# Altium schematic sheet VCO.SchDoc (part 3 of 3)
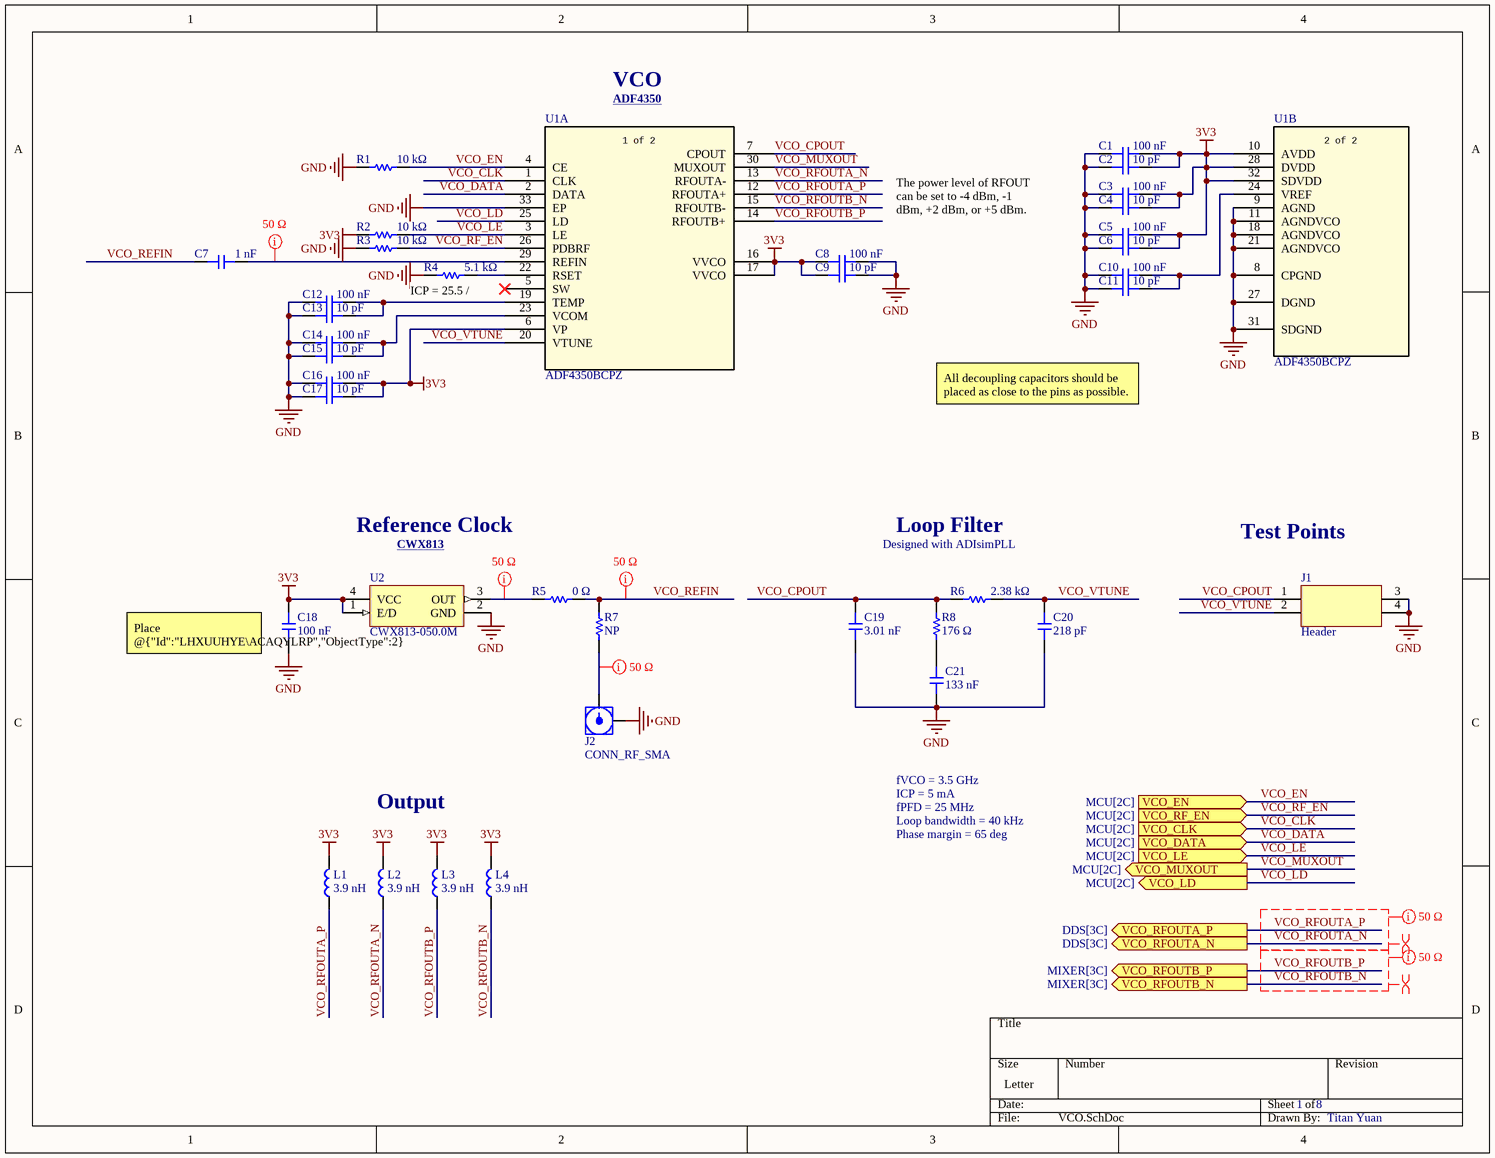
[diagram p2: VCO.SchDoc]

## Library data of the parts (continued)
R4 = RES: 62.5mW Thick Film Resistors 50V ±100ppm/℃ ±1% 5.1kΩ 0402 Chip Resistor - Surface Mount ROHS; Manufacturer: Yageo; Manufacturer Part Number: RC0402FR-075K1L; Tolerance: +-1%; Power Rating: 1/16 W; Max Power Dissipation: 63mW; Temperature Coefficient: 100ppm/°C; Package Size: 0402; Supplier: DigiKey; Supplier Part Number: 311-5.10KLRCT-ND; RoHS: Compliant; Category: Chip SMD Resistors; Stock: 744508; Pricing: 1=0.1, 10=0.008, 25=0.0068, 50=0.005, 100=0.0046, 250=0.00328, 10000=0.00204, 20000=0.002, 30000=0.00196, 50000=0.00182, 70000=0.00181 (USD); Case/Package: 0402; Case Code (Imperial): 0402; China RoHS: Non-Compliant; Composition: Thick Film; Country of Origin: Mainland China, Taiwan; Depth: 500µm; Export Control Classification Number (ECCN) Code: EAR99; Features: Moisture Resistant; Height: 350µm; Harmonized Tariff Schedule (HTS) Code: 8533.21.00.30; Introduction Date: 2008-07-18; Lead Free: Lead Free; Length: 1mm; Lifecycle Status: Production; Max Operating Temperature: 155°C; Military Standard: Not; Min Operating Temperature: -55°C; Mounting Technology: Surface Mount; Pins: 2; Number of Terminals: 2; Number of Terminations: 2; Packaging: Cut Tape; Power Dissipation: 62.5mW; REACH SVHC: Yes; Value: 5.1kΩ; Schedule B: 8533210045, 8533210045|8533210045, 8533210045|8533210045|8533210045, 8533210045|8533210045|8533210045|8533210045; Termination: SMD/SMT; Voltage Rating: 50V; Voltage Rating (DC): 50V; Width: 500µm; Working Voltage: 50V; ComponentLink1URL: https://datasheet.octopart.com:443/RC0402FR-075K1L-Yageo-datasheet-175887523.pdf?src-supplier=IHS; ComponentLink1Description: https://datasheet.octopart.com:443/RC0402FR-075K1L-Yageo-datasheet-175887523.pdf?src-supplier=IHS; ComponentLink2URL: https://datasheet.octopart.com:443/RC0402FR-075K1L-Yageo-datasheet-103092701.pdf?src-supplier=Upverter; ComponentLink2Description: https://datasheet.octopart.com:443/RC0402FR-075K1L-Yageo-datasheet-103092701.pdf?src-supplier=Upverter; ComponentLink3URL: https://datasheet.octopart.com:443/RC0402FR-075K1L-Yageo-Group-datasheet-190305687.pdf?src-supplier=Future+Electronics; ComponentLink3Description: https://datasheet.octopart.com:443/RC0402FR-075K1L-Yageo-Group-datasheet-190305687.pdf?src-supplier=Future+Electronics; ComponentLink4URL: https://datasheet.octopart.com:443/RC0402FR-075K1L-Yageo-datasheet-164759695.pdf?src-supplier=Future+Electronics; ComponentLink4Description: https://datasheet.octopart.com:443/RC0402FR-075K1L-Yageo-datasheet-164759695.pdf?src-supplier=Future+Electronics; ComponentLink5URL: https://datasheet.octopart.com:443/RC0402FR-075K1L-Yageo-datasheet-137700087.pdf?src-supplier=Future+Electronics; ComponentLink5Description: https://datasheet.octopart.com:443/RC0402FR-075K1L-Yageo-datasheet-137700087.pdf?src-supplier=Future+Electronics; ComponentLink6URL: https://datasheet.octopart.com:443/RC0402FR-075K1L-Yageo-datasheet-12531192.pdf?src-supplier=Future+Electronics; ComponentLink6Description: https://datasheet.octopart.com:443/RC0402FR-075K1L-Yageo-datasheet-12531192.pdf?src-supplier=Future+Electronics; ComponentLink7URL: https://datasheet.octopart.com:443/RC0402FR-075K1L-Yageo-datasheet-505231.pdf?src-supplier=Future+Electronics; ComponentLink7Description: https://datasheet.octopart.com:443/RC0402FR-075K1L-Yageo-datasheet-505231.pdf?src-supplier=Future+Electronics; ComponentLink8URL: https://datasheet.octopart.com:443/RC0402FR-075K1L-Yageo-datasheet-10408619.pdf?src-supplier=Newark; ComponentLink8Description: https://datasheet.octopart.com:443/RC0402FR-075K1L-Yageo-datasheet-10408619.pdf?src-supplier=Newark; ComponentLink9URL: https://datasheet.octopart.com:443/RC0402FR-075K1L-Yageo-datasheet-8324527.pdf?src-supplier=Newark; ComponentLink9Description: https://datasheet.octopart.com:443/RC0402FR-075K1L-Yageo-datasheet-8324527.pdf?src-supplier=Newark; ComponentLink10URL: https://datasheet.octopart.com:443/RC0402FR-075K1L-Yageo-datasheet-62067350.pdf?src-supplier=element14+APAC; ComponentLink10Description: https://datasheet.octopart.com:443/RC0402FR-075K1L-Yageo-datasheet-62067350.pdf?src-supplier=element14+APAC; ComponentLink11URL: https://datasheet.octopart.com:443/RC0402FR-075K1L-Yageo-datasheet-148775077.pdf?src-supplier=TME; ComponentLink11Description: https://datasheet.octopart.com:443/RC0402FR-075K1L-Yageo-datasheet-148775077.pdf?src-supplier=TME; ComponentLink12URL: https://datasheet.octopart.com/RC0402FR-075K1L-Yageo-datasheet-73766026.pdf; ComponentLink12Description: https://datasheet.octopart.com/RC0402FR-075K1L-Yageo-datasheet-73766026.pdf; ComponentLink13URL: https://datasheet.octopart.com:443/RC0402FR-075K1L-Yageo-datasheet-8329306.pdf?src-supplier=element14; ComponentLink13Description: https://datasheet.octopart.com:443/RC0402FR-075K1L-Yageo-datasheet-8329306.pdf?src-supplier=element14; ComponentLink14URL: http://sigma.octopart.com:80/conflict_mineral_statement/Yageo-company-3.pdf?src-supplier=Compliance+Statements; ComponentLink14Description: http://sigma.octopart.com:80/conflict_mineral_statement/Yageo-company-3.pdf?src-supplier=Compliance+Statements; ComponentLink15URL: http://sigma.octopart.com:80/rohs_statement/Yageo-company-2.pdf?src-supplier=Compliance+Statements; ComponentLink15Description: http://sigma.octopart.com:80/rohs_statement/Yageo-company-2.pdf?src-supplier=Compliance+Statements
R5 = RES: GENERAL PURPOSE CHIP RESISTOR Metal Glaze/thick Film, 0.0625W, 0ohm, Surface Mount, 0402; Manufacturer: Yageo; Manufacturer Part Number: RC0402FR-070RL; Power Rating: 1/16 W; Power Dissipation: 62.5mW; Value: 0Ω; Voltage Rating: 50V; Tolerance: *; Package Size: 0402; Supplier: DigiKey; Supplier Part Number: 311-0.0LRCT-ND; RoHS: Compliant; Category: Chip SMD Resistors; Stock: 6847013; Pricing: 1=0.1, 10=0.010, 25=0.0064, 50=0.0054, 100=0.0047, 250=0.00392, 500=0.00346, 1000=0.00304, 5000=0.0023 (USD); Case/Package: 0402; Case Code (Imperial): 0402; Case Code (Metric): 1005; China RoHS: Non-Compliant; Composition: Thick Film; Contact Plating: Tin; Country of Origin: Mainland China, Taiwan; Export Control Classification Number (ECCN) Code: EAR99; Height: 350µm; Harmonized Tariff Schedule (HTS) Code: 8533.21.00.30; Introduction Date: 2004-09-22; Lead Free: Lead Free; Length: 1mm; Lifecycle Status: Production; Max Operating Temperature: 155°C; Min Operating Temperature: -55°C; Mounting Technology: Surface Mount; Number of Terminals: 2; Packaging: Tape & Reel; Radiation Hardening: No; REACH SVHC: Yes; Termination: SMD/SMT; Width: 500µm; ComponentLink1URL: https://datasheet.octopart.com:443/RC0402FR-070RL-Yageo-datasheet-141265859.pdf?src-supplier=Upverter; ComponentLink1Description: https://datasheet.octopart.com:443/RC0402FR-070RL-Yageo-datasheet-141265859.pdf?src-supplier=Upverter; ComponentLink2URL: https://sigma.octopart.com:443/138820526/technical_drawing/Yageo-RC0402FR-070RL.pdf?src-supplier=Upverter; ComponentLink2Description: https://sigma.octopart.com:443/138820526/technical_drawing/Yageo-RC0402FR-070RL.pdf?src-supplier=Upverter; ComponentLink3URL: https://datasheet.octopart.com:443/RC0402FR-070RL-Yageo-datasheet-12531192.pdf?src-supplier=IHS; ComponentLink3Description: https://datasheet.octopart.com:443/RC0402FR-070RL-Yageo-datasheet-12531192.pdf?src-supplier=IHS; ComponentLink4URL: https://datasheet.octopart.com:443/RC0402FR-070RL-Yageo-Group-datasheet-176638170.pdf?src-supplier=Future+Electronics; ComponentLink4Description: https://datasheet.octopart.com:443/RC0402FR-070RL-Yageo-Group-datasheet-176638170.pdf?src-supplier=Future+Electronics; ComponentLink5URL: https://datasheet.octopart.com:443/RC0402FR-070RL-Yageo-datasheet-164759695.pdf?src-supplier=Future+Electronics; ComponentLink5Description: https://datasheet.octopart.com:443/RC0402FR-070RL-Yageo-datasheet-164759695.pdf?src-supplier=Future+Electronics; ComponentLink6URL: https://datasheet.octopart.com:443/RC0402FR-070RL-Yageo-datasheet-137700087.pdf?src-supplier=Future+Electronics; ComponentLink6Description: https://datasheet.octopart.com:443/RC0402FR-070RL-Yageo-datasheet-137700087.pdf?src-supplier=Future+Electronics; ComponentLink7URL: https://datasheet.octopart.com:443/RC0402FR-070RL-Yageo-datasheet-10408619.pdf?src-supplier=Future+Electronics; ComponentLink7Description: https://datasheet.octopart.com:443/RC0402FR-070RL-Yageo-datasheet-10408619.pdf?src-supplier=Future+Electronics; ComponentLink8URL: https://datasheet.octopart.com:443/RC0402FR-070RL-Yageo-datasheet-8324527.pdf?src-supplier=Future+Electronics; ComponentLink8Description: https://datasheet.octopart.com:443/RC0402FR-070RL-Yageo-datasheet-8324527.pdf?src-supplier=Future+Electronics; ComponentLink9URL: https://datasheet.octopart.com:443/RC0402FR-070RL-Yageo-datasheet-79472498.pdf?src-supplier=Megastar; ComponentLink9Description: https://datasheet.octopart.com:443/RC0402FR-070RL-Yageo-datasheet-79472498.pdf?src-supplier=Megastar; ComponentLink10URL: https://datasheet.octopart.com/RC0402FR-070RL-Yageo-datasheet-73766026.pdf; ComponentLink10Description: https://datasheet.octopart.com/RC0402FR-070RL-Yageo-datasheet-73766026.pdf; ComponentLink11URL: http://sigma.octopart.com:80/conflict_mineral_statement/Yageo-company-3.pdf?src-supplier=Compliance+Statements; ComponentLink11Description: http://sigma.octopart.com:80/conflict_mineral_statement/Yageo-company-3.pdf?src-supplier=Compliance+Statements; ComponentLink12URL: http://sigma.octopart.com:80/rohs_statement/Yageo-company-2.pdf?src-supplier=Compliance+Statements; ComponentLink12Description: http://sigma.octopart.com:80/rohs_statement/Yageo-company-2.pdf?src-supplier=Compliance+Statements
R6 = RES: 100mW Thin Film Resistor ±25ppm/℃ ±0.1% 2.37kΩ 0603 Chip Resistor - Surface Mount ROHS; Manufacturer: Yageo; Manufacturer Part Number: RT0603BRD072K37L; Tolerance: +-0.1%; Power Rating: 1/10 W; Temperature Coefficient: 25ppm/°C; Voltage Rating: 75V; Voltage Rating (DC): 50V; Package Size: 0603; Supplier: DigiKey; Supplier Part Number: YAG4523CT-ND; RoHS: Compliant; Category: Chip SMD Resistors; Stock: 31067; Pricing: 1=0.1, 10=0.048, 25=0.0476, 50=0.047, 100=0.0468, 250=0.04432 (USD); Case/Package: 0603; Case Code (Imperial): 0603; China RoHS: Non-Compliant; Composition: Thin Film; Contact Plating: Tin; Country of Origin: Mainland China, Taiwan; Depth: 800µm; Export Control Classification Number (ECCN) Code: EAR99; Height: 450µm; Harmonized Tariff Schedule (HTS) Code: 8533.21.00.30; Introduction Date: 2008-06-09; Lead Free: Lead Free; Length: 1.6mm; Lifecycle Status: Production; Max Operating Temperature: 155°C; Military Standard: Not; Min Operating Temperature: -55°C; Mounting Technology: Surface Mount; Number of Terminals: 2; Power Dissipation: 100mW; Radiation Hardening: No; REACH SVHC: Yes; Value: 2.37kΩ; Termination: SMD/SMT; Width: 800µm; Working Voltage: 75V; ComponentLink1URL: https://datasheet.octopart.com:443/RT0603BRD072K37L-Yageo-datasheet-176402239.pdf?src-supplier=Future+Electronics; ComponentLink1Description: https://datasheet.octopart.com:443/RT0603BRD072K37L-Yageo-datasheet-176402239.pdf?src-supplier=Future+Electronics; ComponentLink2URL: https://datasheet.octopart.com:443/RT0603BRD072K37L-Yageo-datasheet-169971040.pdf?src-supplier=Future+Electronics; ComponentLink2Description: https://datasheet.octopart.com:443/RT0603BRD072K37L-Yageo-datasheet-169971040.pdf?src-supplier=Future+Electronics; ComponentLink3URL: https://datasheet.octopart.com:443/RT0603BRD072K37L-Yageo-datasheet-164439670.pdf?src-supplier=Future+Electronics; ComponentLink3Description: https://datasheet.octopart.com:443/RT0603BRD072K37L-Yageo-datasheet-164439670.pdf?src-supplier=Future+Electronics; ComponentLink4URL: https://datasheet.octopart.com:443/RT0603BRD072K37L-Yageo-datasheet-96443642.pdf?src-supplier=Upverter; ComponentLink4Description: https://datasheet.octopart.com:443/RT0603BRD072K37L-Yageo-datasheet-96443642.pdf?src-supplier=Upverter; ComponentLink5URL: https://datasheet.octopart.com/RT0603BRD072K37L-Yageo-datasheet-86813807.pdf; ComponentLink5Description: https://datasheet.octopart.com/RT0603BRD072K37L-Yageo-datasheet-86813807.pdf; ComponentLink6URL: http://sigma.octopart.com:80/conflict_mineral_statement/Yageo-company-3.pdf?src-supplier=Compliance+Statements; ComponentLink6Description: http://sigma.octopart.com:80/conflict_mineral_statement/Yageo-company-3.pdf?src-supplier=Compliance+Statements; ComponentLink7URL: http://sigma.octopart.com:80/rohs_statement/Yageo-company-2.pdf?src-supplier=Compliance+Statements; ComponentLink7Description: http://sigma.octopart.com:80/rohs_statement/Yageo-company-2.pdf?src-supplier=Compliance+Statements
R7 = RES: Resistor SMD Generic; Manufacturer: *; Manufacturer Part Number: *; Tolerance: *; Power Rating: *; Package Size: 0402
R8 = RES: Fixed Resistor, Thin Film, 0.1W, 174ohm, 75V, 0.1% +/-Tol, 25ppm/Cel, Surface Mount, 0603; Manufacturer: Yageo; Manufacturer Part Number: RT0603BRD07174RL; Tolerance: +-0.1%; Power Rating: 1/10 W; Max Power Dissipation: 100mW; Value: 174Ω; Temperature Coefficient: 25ppm/°C; Voltage Rating (DC): 50V; Package Size: 0603; Supplier: DigiKey; Supplier Part Number: 13-RT0603BRD07174RLCT-ND; RoHS: Compliant; Category: Chip SMD Resistors; Stock: 6832; Pricing: 1=0.13, 10=0.05, 25=0.0496, 50=0.049, 100=0.0469, 250=0.04592, 500=0.04432 (USD); Case/Package: 0603; Case Code (Imperial): 0603; China RoHS: Non-Compliant; Composition: Thin Film; Country of Origin: Mainland China, Taiwan; Export Control Classification Number (ECCN) Code: EAR99; Height: 450µm; Harmonized Tariff Schedule (HTS) Code: 8533.21.00.30; Introduction Date: 2008-06-09; Lead Free: Lead Free; Length: 1.6mm; Lifecycle Status: Production; Max Operating Temperature: 155°C; Min Operating Temperature: -55°C; Mounting Technology: Surface Mount; Number of Terminals: 2; Number of Terminations: 2; Power Dissipation: 100mW; REACH SVHC: Yes; Termination: SMD/SMT; Voltage Rating: 75V; Weight: 2.012816mg; Width: 800µm; Working Voltage: 75V; ComponentLink1URL: https://datasheet.octopart.com:443/RT0603BRD07174RL-Yageo-datasheet-176402239.pdf?src-supplier=IHS; ComponentLink1Description: https://datasheet.octopart.com:443/RT0603BRD07174RL-Yageo-datasheet-176402239.pdf?src-supplier=IHS; ComponentLink2URL: https://datasheet.octopart.com:443/RT0603BRD07174RL-Yageo-datasheet-96443642.pdf?src-supplier=Upverter; ComponentLink2Description: https://datasheet.octopart.com:443/RT0603BRD07174RL-Yageo-datasheet-96443642.pdf?src-supplier=Upverter; ComponentLink3URL: https://datasheet.octopart.com/RT0603BRD07174RL-Yageo-datasheet-86813807.pdf; ComponentLink3Description: https://datasheet.octopart.com/RT0603BRD07174RL-Yageo-datasheet-86813807.pdf; ComponentLink4URL: http://sigma.octopart.com:80/conflict_mineral_statement/Yageo-company-3.pdf?src-supplier=Compliance+Statements; ComponentLink4Description: http://sigma.octopart.com:80/conflict_mineral_statement/Yageo-company-3.pdf?src-supplier=Compliance+Statements; ComponentLink5URL: http://sigma.octopart.com:80/rohs_statement/Yageo-company-2.pdf?src-supplier=Compliance+Statements; ComponentLink5Description: http://sigma.octopart.com:80/rohs_statement/Yageo-company-2.pdf?src-supplier=Compliance+Statements
U1 = ADF4350BCPZ: Clock Generator/Frequency Synthesizer /PLL; Manufacturer_Name: Analog Devices Inc; Manufacturer: Analog Devices; Manufacturer Lifecycle Status: PRODUCTION; Frequency: 4.4GHz; Input: CMOS; Interface: SPI; Max Supply Current: 110mA; Max Supply Voltage: 3.6V; Min Supply Voltage: 3V; Number of Circuits: 1; Operating Supply Voltage: 3.3V; PLL: Yes; Copyright: Copyright (C) 2026 Ultra Librarian. All rights reserved.; Manufacturer_Part_Number: ADF4350BCPZ; RefDes: RefDes; Type: Type; Supplier: DigiKey; Supplier Part Number: 505-ADF4350BCPZ-ND; Manufacturer Part Number: ADF4350BCPZ; RoHS: Compliant; Category: Clock Generators, PLLs, Frequency Synthesizers; Stock: 1019; Pricing: 1=19.03, 10=15.163, 60=13.479, 120=13.02358, 300=12.54283, 540=12.29357 (USD); Case/Package: LFCSP EP; Contact Plating: Tin; Height: 1mm; Lead Free: Contains Lead; Length: 5mm; Lifecycle Status: Production; Clock Frequency: 4.4GHz; Max Operating Temperature: 85°C; Min Operating Temperature: -40°C; Mounting Technology: Surface Mount; Nominal Supply Current: 110mA; Number of Elements: 1; Pins: 32; Operating Supply Current: 110mA; Radiation Hardening: No; REACH SVHC: No; Schedule B: 8542390000, 8542390000|8542390000, 8542390000|8542390000|8542390000, 8542390000|8542390000|8542390000|8542390000; Width: 5mm; ComponentLink1URL: https://datasheet.octopart.com:443/ADF4350BCPZ-Analog-Devices-datasheet-10205825.pdf?src-supplier=Upverter; ComponentLink1Description: https://datasheet.octopart.com:443/ADF4350BCPZ-Analog-Devices-datasheet-10205825.pdf?src-supplier=Upverter; ComponentLink2URL: https://octopart.com:443/opatz8j6/c1?t=udrQOUzfFkOAWyWAEA7cqyFayNhf2KNKKGDfYFMB6GZaSb9CZKSMEHKf7pCuHUxopdhw1hcC7xAdPkTKiAktXH3bJB1pk1Tul7797cYMBauL9PkUTbFj8mq-mjLrrAdHNf2Y0KXY0WQPa22DRj8jl23FaNl_jcqCZT16psWAl7DzDR0kRYgmIVr9bT9oCEFpgRusrPtEnwiqB-UmKCaV5AkWG1Bgv3f-zQuBw2SdvHWw7bMWWq1AvelNNHwf5yPLwLfdUVq50EJMqBgitIW62mqajRG5rOgmWsexFFQUC7lNNoJ3hOKsfQ&src-supplier=Analog+Devices; ComponentLink2Description: https://octopart.com:443/opatz8j6/c1?t=udrQOUzfFkOAWyWAEA7cqyFayNhf2KNKKGDfYFMB6GZaSb9CZKSMEHKf7pCuHUxopdhw1hcC7xAdPkTKiAktXH3bJB1pk1Tul7797cYMBauL9PkUTbFj8mq-mjLrrAdHNf2Y0KXY0WQPa22DRj8jl23FaNl_jcqCZT16psWAl7DzDR0kRYgmIVr9bT9oCEFpgRusrPtEnwiqB-UmKCaV5AkWG1Bgv3f-zQuBw2SdvHWw7bMWWq1AvelNNHwf5yPLwLfdUVq50EJMqBgitIW62mqajRG5rOgmWsexFFQUC7lNNoJ3hOKsfQ&src-supplier=Analog+Devices; ComponentLink3URL: https://datasheet.octopart.com:443/ADF4350BCPZ-Analog-Devices-datasheet-101563323.pdf?src-supplier=Augswan; ComponentLink3Description: https://datasheet.octopart.com:443/ADF4350BCPZ-Analog-Devices-datasheet-101563323.pdf?src-supplier=Augswan; ComponentLink4URL: https://datasheet.octopart.com:443/ADF4350BCPZ-Analog-Devices-datasheet-14078374.pdf?src-supplier=iiiC; ComponentLink4Description: https://datasheet.octopart.com:443/ADF4350BCPZ-Analog-Devices-datasheet-14078374.pdf?src-supplier=iiiC; ComponentLink5URL: http://sigma.octopart.com:80/conflict_mineral_statement/Analog-Devices-company-33.pdf?src-supplier=Compliance+Statements; ComponentLink5Description: http://sigma.octopart.com:80/conflict_mineral_statement/Analog-Devices-company-33.pdf?src-supplier=Compliance+Statements; ComponentLink6URL: https://octopart.com:443/opatz8j6/c1?t=hO5EnkGswmsQRyLGLQUkgpU6XZJ4oAHGDbJsaZ-cnkWEcwnXR2khUFliKBOdHfKJHDj_7fYDDMlN9indiUDA61SujkT4A-IrrTLapyjxUMXVYBI2Njs-S5Bsgu0QoUfOKEuGx9uN4F5Tm9Vv1UtT9wuQfsN1oPSQ-QVDKYRMRdQuDXhVKSc4QVVyJsQ5hZZ8QujgyYB3AFq3lZDEZWAzoRqumeJreF-_0GYsVeeCsxZ0MdFP1epUicUX-Jrxjyb0gPoN6PCy9QbdXqe6zvs8NiU2r4fzKarPe-jEPhSgDPozoJAIcHNTxQ&src-supplier=Compliance+Statements; ComponentLink6Description: https://octopart.com:443/opatz8j6/c1?t=hO5EnkGswmsQRyLGLQUkgpU6XZJ4oAHGDbJsaZ-cnkWEcwnXR2khUFliKBOdHfKJHDj_7fYDDMlN9indiUDA61SujkT4A-IrrTLapyjxUMXVYBI2Njs-S5Bsgu0QoUfOKEuGx9uN4F5Tm9Vv1UtT9wuQfsN1oPSQ-QVDKYRMRdQuDXhVKSc4QVVyJsQ5hZZ8QujgyYB3AFq3lZDEZWAzoRqumeJreF-_0GYsVeeCsxZ0MdFP1epUicUX-Jrxjyb0gPoN6PCy9QbdXqe6zvs8NiU2r4fzKarPe-jEPhSgDPozoJAIcHNTxQ&src-supplier=Compliance+Statements
U2 = CWX813-050.0M: LVCMOS Output Clock Oscillator, 50MHz Nom; Manufacturer: Connor-Winfield; Frequency Stability: +-25 ppm; Supply Voltage: 3.3 V; Body Material: Ceramic; Fall Time: 6ns; Load Capacitance: 15pF; Max Supply Current: 30mA; Max Supply Voltage: 3.465V; Min Supply Voltage: 3.135V; Operating Supply Voltage: 3.3V; Manufacturer Part Number: CWX813-050.0M; Frequency: 50 MHz; Temperature Range: -20C to 70C; Supplier: DigiKey; Supplier Part Number: CW541CT-ND; RoHS: Compliant; Category: Oscillators; Stock: 2464; Pricing: 1=4.46, 10=3.878, 25=3.6668, 50=3.5152, 100=3.37, 250=3.28952 (USD); Case/Package: SMD/SMT; Height: 1.2954mm; Lead Free: Lead Free; Length: 7.0104mm; Lifecycle Status: Production; Max Operating Temperature: 70°C; Min Operating Temperature: -20°C; Mounting Technology: Surface Mount; Nominal Supply Current: 30mA; Number of Terminals: 4; Output Type: LVCMOS; REACH SVHC: Yes; Rise Time: 6ns; Width: 5.0038mm; ComponentLink1URL: https://datasheet.octopart.com:443/CWX813-050.0M-Connor-Winfield-datasheet-14434119.pdf?src-supplier=IHS; ComponentLink1Description: https://datasheet.octopart.com:443/CWX813-050.0M-Connor-Winfield-datasheet-14434119.pdf?src-supplier=IHS